# Altium project ADH_XC7Z010_SoC.PrjPcb (part 9 of 10)

## Sheet DDR3L_Modules.SchDoc: DDR3L Modules
size A3; DrawnBy: Emre Can Damyanlı; Revision: A.1; SheetNumber: 8; SheetTotal: 8; ENG_APP_DATE: --/--/--; DSN_APP_DATE: --/--/--; CHK_APP_DATE: --/--/--
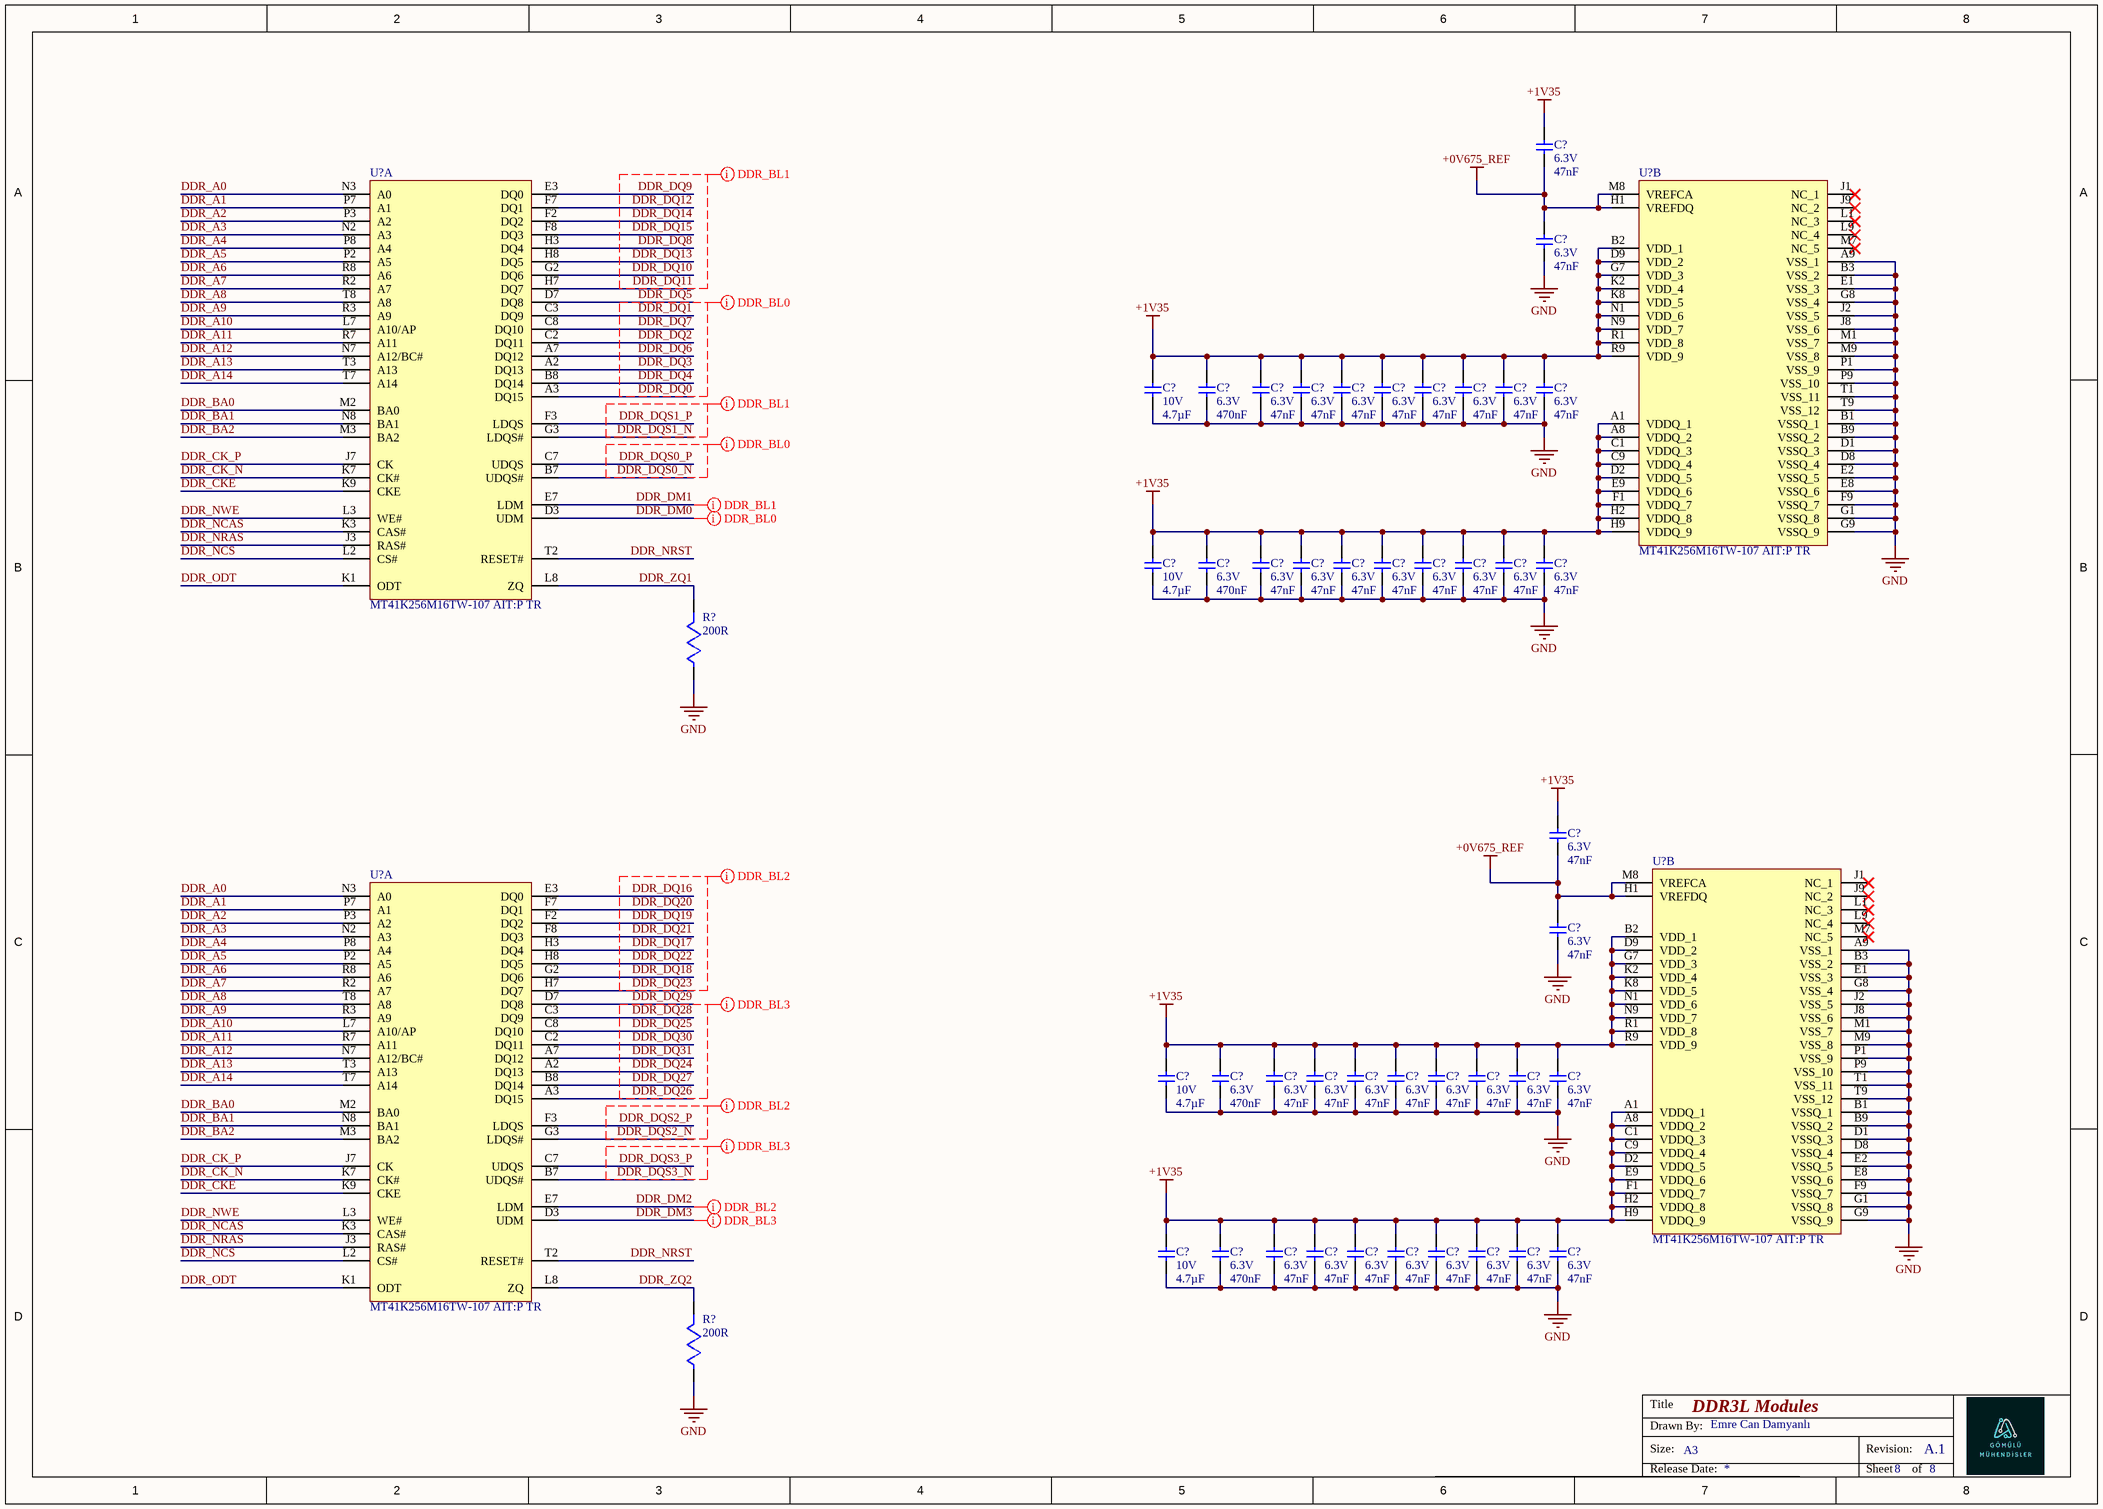
[diagram p7: DDR3L_Modules.SchDoc]

### Parts
(Parts that share a designator on the sheet are numbered #1, #2 ... from top to bottom, then left to right.)
C?#143  value 47nF  Voltage Rating: 6.3V  [CAPC0603X33N]  (hidden comment: GRM033C80J473KE19D)
C?#144  value 47nF  Voltage Rating: 6.3V  [CAPC0603X33N]  (hidden comment: GRM033C80J473KE19D)
C?#145  value 4.7µF  Voltage Rating: 10V  [CAPC1005X55N]  (hidden comment: CL05A475MP5NRNC)
C?#146  value 470nF  Voltage Rating: 6.3V  [CAPC0603X33N]  (hidden comment: GRM033R60J474KE90D)
C?#147  value 47nF  Voltage Rating: 6.3V  [CAPC0603X33N]  (hidden comment: GRM033C80J473KE19D)
C?#148  value 47nF  Voltage Rating: 6.3V  [CAPC0603X33N]  (hidden comment: GRM033C80J473KE19D)
C?#149  value 47nF  Voltage Rating: 6.3V  [CAPC0603X33N]  (hidden comment: GRM033C80J473KE19D)
C?#150  value 47nF  Voltage Rating: 6.3V  [CAPC0603X33N]  (hidden comment: GRM033C80J473KE19D)
C?#151  value 47nF  Voltage Rating: 6.3V  [CAPC0603X33N]  (hidden comment: GRM033C80J473KE19D)
C?#152  value 47nF  Voltage Rating: 6.3V  [CAPC0603X33N]  (hidden comment: GRM033C80J473KE19D)
C?#153  value 47nF  Voltage Rating: 6.3V  [CAPC0603X33N]  (hidden comment: GRM033C80J473KE19D)
C?#154  value 47nF  Voltage Rating: 6.3V  [CAPC0603X33N]  (hidden comment: GRM033C80J473KE19D)
C?#155  value 4.7µF  Voltage Rating: 10V  [CAPC1005X55N]  (hidden comment: CL05A475MP5NRNC)
C?#156  value 470nF  Voltage Rating: 6.3V  [CAPC0603X33N]  (hidden comment: GRM033R60J474KE90D)
C?#157  value 47nF  Voltage Rating: 6.3V  [CAPC0603X33N]  (hidden comment: GRM033C80J473KE19D)
C?#158  value 47nF  Voltage Rating: 6.3V  [CAPC0603X33N]  (hidden comment: GRM033C80J473KE19D)
C?#159  value 47nF  Voltage Rating: 6.3V  [CAPC0603X33N]  (hidden comment: GRM033C80J473KE19D)
C?#160  value 47nF  Voltage Rating: 6.3V  [CAPC0603X33N]  (hidden comment: GRM033C80J473KE19D)
C?#161  value 47nF  Voltage Rating: 6.3V  [CAPC0603X33N]  (hidden comment: GRM033C80J473KE19D)
C?#162  value 47nF  Voltage Rating: 6.3V  [CAPC0603X33N]  (hidden comment: GRM033C80J473KE19D)
C?#163  value 47nF  Voltage Rating: 6.3V  [CAPC0603X33N]  (hidden comment: GRM033C80J473KE19D)
C?#164  value 47nF  Voltage Rating: 6.3V  [CAPC0603X33N]  (hidden comment: GRM033C80J473KE19D)
C?#165  value 47nF  Voltage Rating: 6.3V  [CAPC0603X33N]  (hidden comment: GRM033C80J473KE19D)
C?#166  value 47nF  Voltage Rating: 6.3V  [CAPC0603X33N]  (hidden comment: GRM033C80J473KE19D)
C?#167  value 4.7µF  Voltage Rating: 10V  [CAPC1005X55N]  (hidden comment: CL05A475MP5NRNC)
C?#168  value 470nF  Voltage Rating: 6.3V  [CAPC0603X33N]  (hidden comment: GRM033R60J474KE90D)
C?#169  value 47nF  Voltage Rating: 6.3V  [CAPC0603X33N]  (hidden comment: GRM033C80J473KE19D)
C?#170  value 47nF  Voltage Rating: 6.3V  [CAPC0603X33N]  (hidden comment: GRM033C80J473KE19D)
C?#171  value 47nF  Voltage Rating: 6.3V  [CAPC0603X33N]  (hidden comment: GRM033C80J473KE19D)
C?#172  value 47nF  Voltage Rating: 6.3V  [CAPC0603X33N]  (hidden comment: GRM033C80J473KE19D)
C?#173  value 47nF  Voltage Rating: 6.3V  [CAPC0603X33N]  (hidden comment: GRM033C80J473KE19D)
C?#174  value 47nF  Voltage Rating: 6.3V  [CAPC0603X33N]  (hidden comment: GRM033C80J473KE19D)
C?#175  value 47nF  Voltage Rating: 6.3V  [CAPC0603X33N]  (hidden comment: GRM033C80J473KE19D)
C?#176  value 47nF  Voltage Rating: 6.3V  [CAPC0603X33N]  (hidden comment: GRM033C80J473KE19D)
C?#177  value 4.7µF  Voltage Rating: 10V  [CAPC1005X55N]  (hidden comment: CL05A475MP5NRNC)
C?#178  value 470nF  Voltage Rating: 6.3V  [CAPC0603X33N]  (hidden comment: GRM033R60J474KE90D)
C?#179  value 47nF  Voltage Rating: 6.3V  [CAPC0603X33N]  (hidden comment: GRM033C80J473KE19D)
C?#180  value 47nF  Voltage Rating: 6.3V  [CAPC0603X33N]  (hidden comment: GRM033C80J473KE19D)
C?#181  value 47nF  Voltage Rating: 6.3V  [CAPC0603X33N]  (hidden comment: GRM033C80J473KE19D)
C?#182  value 47nF  Voltage Rating: 6.3V  [CAPC0603X33N]  (hidden comment: GRM033C80J473KE19D)
C?#183  value 47nF  Voltage Rating: 6.3V  [CAPC0603X33N]  (hidden comment: GRM033C80J473KE19D)
C?#184  value 47nF  Voltage Rating: 6.3V  [CAPC0603X33N]  (hidden comment: GRM033C80J473KE19D)
C?#185  value 47nF  Voltage Rating: 6.3V  [CAPC0603X33N]  (hidden comment: GRM033C80J473KE19D)
C?#186  value 47nF  Voltage Rating: 6.3V  [CAPC0603X33N]  (hidden comment: GRM033C80J473KE19D)
R?#134  value 200R  [RESISTOR_0603]  (hidden comment: RC0603FR-07200RL)
R?#135  value 200R  [RESISTOR_0603]  (hidden comment: RC0603FR-07200RL)
U?#23  MT41K256M16TW-107 AIT:P TR  [BGA96C80P9X16_800X1400X120]  (part B of 2)
U?#24  MT41K256M16TW-107 AIT:P TR  [BGA96C80P9X16_800X1400X120]  (part A of 2)
U?#25  MT41K256M16TW-107 AIT:P TR  [BGA96C80P9X16_800X1400X120]  (part B of 2)
U?#26  MT41K256M16TW-107 AIT:P TR  [BGA96C80P9X16_800X1400X120]  (part A of 2)

### Nets
+0V675_REF: C?#143.1 C?#144.2 C?#165.1 C?#166.2 U?#23.H1(VREFDQ) U?#23.M8(VREFCA) U?#25.H1(VREFDQ) U?#25.M8(VREFCA)
+1V35: C?#143.2 C?#145.2 C?#146.2 C?#147.2 C?#148.2 C?#149.2 C?#150.2 C?#151.2 C?#152.2 C?#153.2 C?#154.2 C?#155.2 C?#156.2 C?#157.2 C?#158.2 C?#159.2 C?#160.2 C?#161.2 C?#162.2 C?#163.2 C?#164.2 C?#165.2 C?#167.2 C?#168.2 C?#169.2 C?#170.2 C?#171.2 C?#172.2 C?#173.2 C?#174.2 C?#175.2 C?#176.2 C?#177.2 C?#178.2 C?#179.2 C?#180.2 C?#181.2 C?#182.2 C?#183.2 C?#184.2 C?#185.2 C?#186.2 U?#23.A1(VDDQ_1) U?#23.A8(VDDQ_2) U?#23.B2(VDD_1) U?#23.C1(VDDQ_3) U?#23.C9(VDDQ_4) U?#23.D2(VDDQ_5) U?#23.D9(VDD_2) U?#23.E9(VDDQ_6) U?#23.F1(VDDQ_7) U?#23.G7(VDD_3) U?#23.H2(VDDQ_8) U?#23.H9(VDDQ_9) U?#23.K2(VDD_4) U?#23.K8(VDD_5) U?#23.N1(VDD_6) U?#23.N9(VDD_7) U?#23.R1(VDD_8) U?#23.R9(VDD_9) U?#25.A1(VDDQ_1) U?#25.A8(VDDQ_2) U?#25.B2(VDD_1) U?#25.C1(VDDQ_3) U?#25.C9(VDDQ_4) U?#25.D2(VDDQ_5) U?#25.D9(VDD_2) U?#25.E9(VDDQ_6) U?#25.F1(VDDQ_7) U?#25.G7(VDD_3) U?#25.H2(VDDQ_8) U?#25.H9(VDDQ_9) U?#25.K2(VDD_4) U?#25.K8(VDD_5) U?#25.N1(VDD_6) U?#25.N9(VDD_7) U?#25.R1(VDD_8) U?#25.R9(VDD_9)
GND: C?#144.1 C?#145.1 C?#146.1 C?#147.1 C?#148.1 C?#149.1 C?#150.1 C?#151.1 C?#152.1 C?#153.1 C?#154.1 C?#155.1 C?#156.1 C?#157.1 C?#158.1 C?#159.1 C?#160.1 C?#161.1 C?#162.1 C?#163.1 C?#164.1 C?#166.1 C?#167.1 C?#168.1 C?#169.1 C?#170.1 C?#171.1 C?#172.1 C?#173.1 C?#174.1 C?#175.1 C?#176.1 C?#177.1 C?#178.1 C?#179.1 C?#180.1 C?#181.1 C?#182.1 C?#183.1 C?#184.1 C?#185.1 C?#186.1 R?#134.1 R?#135.1 U?#23.A9(VSS_1) U?#23.B1(VSSQ_1) U?#23.B3(VSS_2) U?#23.B9(VSSQ_2) U?#23.D1(VSSQ_3) U?#23.D8(VSSQ_4) U?#23.E1(VSS_3) U?#23.E2(VSSQ_5) U?#23.E8(VSSQ_6) U?#23.F9(VSSQ_7) U?#23.G1(VSSQ_8) U?#23.G8(VSS_4) U?#23.G9(VSSQ_9) U?#23.J2(VSS_5) U?#23.J8(VSS_6) U?#23.M1(VSS_7) U?#23.M9(VSS_8) U?#23.P1(VSS_9) U?#23.P9(VSS_10) U?#23.T1(VSS_11) U?#23.T9(VSS_12) U?#25.A9(VSS_1) U?#25.B1(VSSQ_1) U?#25.B3(VSS_2) U?#25.B9(VSSQ_2) U?#25.D1(VSSQ_3) U?#25.D8(VSSQ_4) U?#25.E1(VSS_3) U?#25.E2(VSSQ_5) U?#25.E8(VSSQ_6) U?#25.F9(VSSQ_7) U?#25.G1(VSSQ_8) U?#25.G8(VSS_4) U?#25.G9(VSSQ_9) U?#25.J2(VSS_5) U?#25.J8(VSS_6) U?#25.M1(VSS_7) U?#25.M9(VSS_8) U?#25.P1(VSS_9) U?#25.P9(VSS_10) U?#25.T1(VSS_11) U?#25.T9(VSS_12)
DDR_A0: U?#24.N3(A0) U?#26.N3(A0)
DDR_A1: U?#24.P7(A1) U?#26.P7(A1)
DDR_A2: U?#24.P3(A2) U?#26.P3(A2)
DDR_A3: U?#24.N2(A3) U?#26.N2(A3)
DDR_A4: U?#24.P8(A4) U?#26.P8(A4)
DDR_A5: U?#24.P2(A5) U?#26.P2(A5)
DDR_A6: U?#24.R8(A6) U?#26.R8(A6)
DDR_A7: U?#24.R2(A7) U?#26.R2(A7)
DDR_A8: U?#24.T8(A8) U?#26.T8(A8)
DDR_A9: U?#24.R3(A9) U?#26.R3(A9)
DDR_A10: U?#24.L7(A10/AP) U?#26.L7(A10/AP)
DDR_A11: U?#24.R7(A11) U?#26.R7(A11)
DDR_A12: U?#24.N7(A12/BC#) U?#26.N7(A12/BC#)
DDR_A13: U?#24.T3(A13) U?#26.T3(A13)
DDR_A14: U?#24.T7(A14) U?#26.T7(A14)
DDR_BA0: U?#24.M2(BA0) U?#26.M2(BA0)
DDR_BA1: U?#24.N8(BA1) U?#26.N8(BA1)
DDR_BA2: U?#24.M3(BA2) U?#26.M3(BA2)
DDR_CK_N: U?#24.K7(CK#) U?#26.K7(CK#)
DDR_CK_P: U?#24.J7(CK) U?#26.J7(CK)
DDR_CKE: U?#24.K9(CKE) U?#26.K9(CKE)
DDR_DM0: U?#24.D3(UDM)
DDR_DM1: U?#24.E7(LDM)
DDR_DM2: U?#26.E7(LDM)
DDR_DM3: U?#26.D3(UDM)
DDR_DQ0: U?#24.A3(DQ15)
DDR_DQ1: U?#24.C3(DQ9)
DDR_DQ2: U?#24.C2(DQ11)
DDR_DQ3: U?#24.A2(DQ13)
DDR_DQ4: U?#24.B8(DQ14)
DDR_DQ5: U?#24.D7(DQ8)
DDR_DQ6: U?#24.A7(DQ12)
DDR_DQ7: U?#24.C8(DQ10)
DDR_DQ8: U?#24.H3(DQ4)
DDR_DQ9: U?#24.E3(DQ0)
DDR_DQ10: U?#24.G2(DQ6)
DDR_DQ11: U?#24.H7(DQ7)
DDR_DQ12: U?#24.F7(DQ1)
DDR_DQ13: U?#24.H8(DQ5)
DDR_DQ14: U?#24.F2(DQ2)
DDR_DQ15: U?#24.F8(DQ3)
DDR_DQ16: U?#26.E3(DQ0)
DDR_DQ17: U?#26.H3(DQ4)
DDR_DQ18: U?#26.G2(DQ6)
DDR_DQ19: U?#26.F2(DQ2)
DDR_DQ20: U?#26.F7(DQ1)
DDR_DQ21: U?#26.F8(DQ3)
DDR_DQ22: U?#26.H8(DQ5)
DDR_DQ23: U?#26.H7(DQ7)
DDR_DQ24: U?#26.A2(DQ13)
DDR_DQ25: U?#26.C8(DQ10)
DDR_DQ26: U?#26.A3(DQ15)
DDR_DQ27: U?#26.B8(DQ14)
DDR_DQ28: U?#26.C3(DQ9)
DDR_DQ29: U?#26.D7(DQ8)
DDR_DQ30: U?#26.C2(DQ11)
DDR_DQ31: U?#26.A7(DQ12)
DDR_DQS0_N: U?#24.B7(UDQS#)
DDR_DQS0_P: U?#24.C7(UDQS)
DDR_DQS1_N: U?#24.G3(LDQS#)
DDR_DQS1_P: U?#24.F3(LDQS)
DDR_DQS2_N: U?#26.G3(LDQS#)
DDR_DQS2_P: U?#26.F3(LDQS)
DDR_DQS3_N: U?#26.B7(UDQS#)
DDR_DQS3_P: U?#26.C7(UDQS)
DDR_NCAS: U?#24.K3(CAS#) U?#26.K3(CAS#)
DDR_NCS: U?#24.L2(CS#) U?#26.L2(CS#)
DDR_NRAS: U?#24.J3(RAS#) U?#26.J3(RAS#)
DDR_NRST: U?#24.T2(RESET#) U?#26.T2(RESET#)
DDR_NWE: U?#24.L3(WE#) U?#26.L3(WE#)
DDR_ODT: U?#24.K1(ODT) U?#26.K1(ODT)
DDR_ZQ1: R?#134.2 U?#24.L8(ZQ)
DDR_ZQ2: R?#135.2 U?#26.L8(ZQ)

Not connected (* = marked no-connect by the designer): U?#23 J1(NC_1)* J9(NC_2)* L1(NC_3)* L9(NC_4)* M7(NC_5)*; U?#25 J1(NC_1)* J9(NC_2)* L1(NC_3)* L9(NC_4)* M7(NC_5)*

### Layout directives
mark named DDR_BL1: DDR_DM1, DDR_DQ8, DDR_DQ9, DDR_DQ10, DDR_DQ11, DDR_DQ12, DDR_DQ13, DDR_DQ14, DDR_DQ15, DDR_DQS1_N, DDR_DQS1_P
mark named DDR_BL0: DDR_DM0, DDR_DQ0, DDR_DQ1, DDR_DQ2, DDR_DQ3, DDR_DQ4, DDR_DQ5, DDR_DQ6, DDR_DQ7, DDR_DQS0_N, DDR_DQS0_P
mark named DDR_BL2: DDR_DM2, DDR_DQ16, DDR_DQ17, DDR_DQ18, DDR_DQ19, DDR_DQ20, DDR_DQ21, DDR_DQ22, DDR_DQ23, DDR_DQS2_N, DDR_DQS2_P
mark named DDR_BL3: DDR_DM3, DDR_DQ24, DDR_DQ25, DDR_DQ26, DDR_DQ27, DDR_DQ28, DDR_DQ29, DDR_DQ30, DDR_DQ31, DDR_DQS3_N, DDR_DQS3_P

### Notes on the sheet
- Title
- Size:
- Drawn By:
- A3
- Revision:
- Release Date:
- Sheet
- of

### Library data of the parts
C?#143 C?#144 C?#147-C?#154 C?#157-C?#166 C?#169-C?#176 C?#179-C?#186 = GRM033C80J473KE19D: 6.3V 47nF X6S ±10% 0201 Multilayer Ceramic Capacitors MLCC - SMD/SMT ROHS; Manufacturer: Murata; Manufacturer Lifecycle Status: IN PRODUCTION; Supplier: Arrow Electronics; Supplier Part Number: GRM033C80J473KE19D; Manufacturer Part Number: GRM033C80J473KE19D; RoHS: Compliant; Category: Ceramic Capacitors; Stock: 1925; Pricing: 1924=0,0007 (USD); Case/Package: 0201; Case Code (Imperial): 0201; Case Code (Metric): 0603; Depth: 300µm; Dielectric: X6S; Dielectric Material: Ceramic; Height: 300µm; Lead Free: Lead Free; Length: 600µm; Lifecycle Status: Production; Material: Ceramic; Max Operating Temperature: 105°C; Min Operating Temperature: -55°C; Mounting Technology: Surface Mount; Number of Terminals: 2; Radiation Hardening: No; REACH SVHC: Yes; Schedule B: 8532240020, 8532240020|8532240020|8532240020|8532240020|8532240020; Termination: SMD/SMT; Thickness: 300µm; Tolerance: 10%; Voltage Rating (DC): 6.3V; Width: 300µm; ComponentLink1URL: https://datasheet.octopart.com:443/GRM033C80J473KE19D-Murata-datasheet-14396169.pdf?src-supplier=Future+Electronics; ComponentLink1Description: https://datasheet.octopart.com:443/GRM033C80J473KE19D-Murata-datasheet-14396169.pdf?src-supplier=Future+Electronics; ComponentLink2URL: https://datasheet.octopart.com:443/GRM033C80J473KE19D-Murata-datasheet-96971104.pdf?src-supplier=Future+Electronics; ComponentLink2Description: https://datasheet.octopart.com:443/GRM033C80J473KE19D-Murata-datasheet-96971104.pdf?src-supplier=Future+Electronics; ComponentLink3URL: https://datasheet.octopart.com:443/GRM033C80J473KE19D-Murata-datasheet-22122223.pdf?src-supplier=Future+Electronics; ComponentLink3Description: https://datasheet.octopart.com:443/GRM033C80J473KE19D-Murata-datasheet-22122223.pdf?src-supplier=Future+Electronics; ComponentLink4URL: https://datasheet.octopart.com:443/GRM033C80J473KE19D-Murata-datasheet-44105362.pdf?src-supplier=Future+Electronics; ComponentLink4Description: https://datasheet.octopart.com:443/GRM033C80J473KE19D-Murata-datasheet-44105362.pdf?src-supplier=Future+Electronics; ComponentLink5URL: https://datasheet.octopart.com:443/GRM033C80J473KE19D-Murata-datasheet-165579666.pdf?src-supplier=TME; ComponentLink5Description: https://datasheet.octopart.com:443/GRM033C80J473KE19D-Murata-datasheet-165579666.pdf?src-supplier=TME; ComponentLink6URL: https://datasheet.octopart.com:443/GRM033C80J473KE19D-Murata-datasheet-141274201.pdf?src-supplier=Ciiva; ComponentLink6Description: https://datasheet.octopart.com:443/GRM033C80J473KE19D-Murata-datasheet-141274201.pdf?src-supplier=Ciiva; ComponentLink7URL: https://datasheet.octopart.com:443/GRM033C80J473KE19D-Murata-datasheet-140675416.pdf?src-supplier=Ciiva; ComponentLink7Description: https://datasheet.octopart.com:443/GRM033C80J473KE19D-Murata-datasheet-140675416.pdf?src-supplier=Ciiva; ComponentLink8URL: https://datasheet.octopart.com:443/GRM033C80J473KE19D-Murata-datasheet-138738209.pdf?src-supplier=Ciiva; ComponentLink8Description: https://datasheet.octopart.com:443/GRM033C80J473KE19D-Murata-datasheet-138738209.pdf?src-supplier=Ciiva; ComponentLink9URL: https://datasheet.octopart.com:443/GRM033C80J473KE19D-Murata-datasheet-32479577.pdf?src-supplier=HQonline; ComponentLink9Description: https://datasheet.octopart.com:443/GRM033C80J473KE19D-Murata-datasheet-32479577.pdf?src-supplier=HQonline; ComponentLink10URL: https://datasheet.octopart.com/GRM033C80J473KE19D-Murata-datasheet-12515295.pdf; ComponentLink10Description: https://datasheet.octopart.com/GRM033C80J473KE19D-Murata-datasheet-12515295.pdf; ComponentLink11URL: https://datasheet.octopart.com/GRM033C80J473KE19D-Murata-datasheet-12510076.pdf; ComponentLink11Description: https://datasheet.octopart.com/GRM033C80J473KE19D-Murata-datasheet-12510076.pdf; ComponentLink12URL: https://datasheet.octopart.com/GRM033C80J473KE19D-Murata-datasheet-11978611.pdf; ComponentLink12Description: https://datasheet.octopart.com/GRM033C80J473KE19D-Murata-datasheet-11978611.pdf; ComponentLink13URL: https://datasheet.octopart.com/GRM033C80J473KE19D-Murata-datasheet-10025737.pdf; ComponentLink13Description: https://datasheet.octopart.com/GRM033C80J473KE19D-Murata-datasheet-10025737.pdf; ComponentLink14URL: https://datasheet.octopart.com/GRM033C80J473KE19D-Murata-datasheet-8819587.pdf; ComponentLink14Description: https://datasheet.octopart.com/GRM033C80J473KE19D-Murata-datasheet-8819587.pdf; ComponentLink15URL: https://datasheet.octopart.com:443/GRM033C80J473KE19D-Murata-datasheet-150009104.pdf?src-supplier=Arrow.cn; ComponentLink15Description: https://datasheet.octopart.com:443/GRM033C80J473KE19D-Murata-datasheet-150009104.pdf?src-supplier=Arrow.cn; ComponentLink16URL: http://sigma.octopart.com:80/reach_statement/Murata-company-16.pdf?src-supplier=Compliance+Statements; ComponentLink16Description: http://sigma.octopart.com:80/reach_statement/Murata-company-16.pdf?src-supplier=Compliance+Statements
C?#145 C?#155 C?#167 C?#177 = CL05A475MP5NRNC: as C?#123-C?#125 on sheet Zynq_PS_System; Supplier: Avnet; Supplier Part Number: CL05A475MP5NRNC; Manufacturer Part Number: CL05A475MP5NRNC; RoHS: Compliant; Category: Ceramic Capacitors; Stock: 40000; Pricing: 10000=0,00671, 20000=0,00663, 40000=0,0066, 80000=0,00656, 160000=0,00653 (USD); Case/Package: 0402; Case Code (Imperial): 0402; Case Code (Metric): 1005; China RoHS: Compliant; Dielectric: X5R; Dielectric Material: Ceramic; Height: 500µm; Lead Free: Lead Free; Length: 1mm; Lifecycle Status: Production; Material: Ceramic; Max Operating Temperature: 85°C; Min Operating Temperature: -55°C; Mounting Technology: Surface Mount; Number of Terminals: 2; REACH SVHC: Yes; Schedule B: 8532240020, 8532240020|8532240020|8532240020|8532240020|8532240020|8532240020|8532240020|8532240020|8532240020|8532240020|8532240020|8532240020|8532240020|8532240020|8532240020|8532240020|8532240020|8532240020|8532240020|8532240020|8532240020|8532240020, 8532240020|8532240020|8532240020|8532240020|8532240020|8532240020|8532240020|8532240020|8532240020|8532240020|8532240020|8532240020|8532240020|8532240020|8532240020|8532240020|8532240020|8532240020|8532240020|8532240020|8532240020|8532240020|8532240020, 8532240020|8532240020|8532240020|8532240020|8532240020|8532240020|8532240020|8532240020|8532240020|8532240020|8532240020|8532240020|8532240020|8532240020|8532240020|8532240020|8532240020|8532240020|8532240020|8532240020|8532240020|8532240020|8532240020|85; Thickness: 558.8µm; Tolerance: 20%; Voltage Rating (DC): 10V; Width: 500µm; ComponentLink1URL: https://datasheet.octopart.com:443/CL05A475MP5NRNC-Samsung-Electro-Mechanics-datasheet-181551186.pdf?src-supplier=Newark; ComponentLink1Description: https://datasheet.octopart.com:443/CL05A475MP5NRNC-Samsung-Electro-Mechanics-datasheet-181551186.pdf?src-supplier=Newark; ComponentLink2URL: https://datasheet.octopart.com:443/CL05A475MP5NRNC-Samsung-Electro-Mechanics-datasheet-136482298.pdf?src-supplier=Newark; ComponentLink2Description: https://datasheet.octopart.com:443/CL05A475MP5NRNC-Samsung-Electro-Mechanics-datasheet-136482298.pdf?src-supplier=Newark; ComponentLink3URL: https://datasheet.octopart.com:443/CL05A475MP5NRNC-Samsung-Electro-Mechanics-datasheet-136031736.pdf?src-supplier=Future+Electronics; ComponentLink3Description: https://datasheet.octopart.com:443/CL05A475MP5NRNC-Samsung-Electro-Mechanics-datasheet-136031736.pdf?src-supplier=Future+Electronics; ComponentLink4URL: https://datasheet.octopart.com:443/CL05A475MP5NRNC-Samsung-Electro-Mechanics-datasheet-110226226.pdf?src-supplier=Future+Electronics; ComponentLink4Description: https://datasheet.octopart.com:443/CL05A475MP5NRNC-Samsung-Electro-Mechanics-datasheet-110226226.pdf?src-supplier=Future+Electronics; ComponentLink5URL: https://datasheet.octopart.com:443/CL05A475MP5NRNC-Samsung-Electro-Mechanics-datasheet-87580058.pdf?src-supplier=Future+Electronics; ComponentLink5Description: https://datasheet.octopart.com:443/CL05A475MP5NRNC-Samsung-Electro-Mechanics-datasheet-87580058.pdf?src-supplier=Future+Electronics; ComponentLink6URL: https://datasheet.octopart.com:443/CL05A475MP5NRNC-Samsung-Electro-Mechanics-datasheet-81461611.pdf?src-supplier=Future+Electronics; ComponentLink6Description: https://datasheet.octopart.com:443/CL05A475MP5NRNC-Samsung-Electro-Mechanics-datasheet-81461611.pdf?src-supplier=Future+Electronics; ComponentLink7URL: https://datasheet.octopart.com:443/CL05A475MP5NRNC-Samsung-datasheet-48647200.pdf?src-supplier=Future+Electronics; ComponentLink7Description: https://datasheet.octopart.com:443/CL05A475MP5NRNC-Samsung-datasheet-48647200.pdf?src-supplier=Future+Electronics; ComponentLink8URL: https://datasheet.octopart.com:443/CL05A475MP5NRNC-Samsung-datasheet-34153549.pdf?src-supplier=Future+Electronics; ComponentLink8Description: https://datasheet.octopart.com:443/CL05A475MP5NRNC-Samsung-datasheet-34153549.pdf?src-supplier=Future+Electronics; ComponentLink9URL: https://datasheet.octopart.com:443/CL05A475MP5NRNC-Samsung-datasheet-26589015.pdf?src-supplier=Future+Electronics; ComponentLink9Description: https://datasheet.octopart.com:443/CL05A475MP5NRNC-Samsung-datasheet-26589015.pdf?src-supplier=Future+Electronics; ComponentLink10URL: https://datasheet.octopart.com:443/CL05A475MP5NRNC-Samsung-datasheet-8324245.pdf?src-supplier=Future+Electronics; ComponentLink10Description: https://datasheet.octopart.com:443/CL05A475MP5NRNC-Samsung-datasheet-8324245.pdf?src-supplier=Future+Electronics; ComponentLink11URL: https://datasheet.octopart.com:443/CL05A475MP5NRNC-Samsung-Electro-Mechanics-datasheet-149136695.pdf?src-supplier=Future+Electronics; ComponentLink11Description: https://datasheet.octopart.com:443/CL05A475MP5NRNC-Samsung-Electro-Mechanics-datasheet-149136695.pdf?src-supplier=Future+Electronics; ComponentLink12URL: https://datasheet.octopart.com:443/CL05A475MP5NRNC-Samsung-datasheet-8326407.pdf?src-supplier=TME; ComponentLink12Description: https://datasheet.octopart.com:443/CL05A475MP5NRNC-Samsung-datasheet-8326407.pdf?src-supplier=TME
C?#146 C?#156 C?#168 C?#178 = GRM033R60J474KE90D: as C?#133-C?#136 on sheet Zynq_DDR_Interface; Supplier: Arrow Electronics; Supplier Part Number: GRM033R60J474KE90D; Manufacturer Part Number: GRM033R60J474KE90D; RoHS: Compliant; Category: Ceramic Capacitors; Stock: 1170000; Pricing: 15000=0,004 (USD); Case/Package: 0201; Case Code (Imperial): 0201; Case Code (Metric): 0603; Depth: 300µm; Dielectric: X5R; Dielectric Material: Ceramic; Height: 300µm; Lead Free: Lead Free; Length: 600µm; Lifecycle Status: Production; Material: Ceramic; Max Operating Temperature: 85°C; Min Operating Temperature: -55°C; Mounting Technology: Surface Mount; Number of Terminals: 2; Packaging: Tape & Reel (TR); REACH SVHC: Yes; Schedule B: 8532240020, 8532240020|8532240020, 8532240020|8532240020|8532240020, 8532240020|8532240020|8532240020|8532240020; Termination: SMD/SMT; Thickness: 300µm; Tolerance: 10%; Voltage Rating (DC): 6.3V; Weight: 340.194278µg; Width: 300µm; ComponentLink1URL: https://datasheet.octopart.com:443/GRM033R60J474KE90D-Murata-datasheet-165579666.pdf?src-supplier=TME; ComponentLink1Description: https://datasheet.octopart.com:443/GRM033R60J474KE90D-Murata-datasheet-165579666.pdf?src-supplier=TME; ComponentLink2URL: https://datasheet.octopart.com:443/GRM033R60J474KE90D-Murata-datasheet-141274201.pdf?src-supplier=Ciiva; ComponentLink2Description: https://datasheet.octopart.com:443/GRM033R60J474KE90D-Murata-datasheet-141274201.pdf?src-supplier=Ciiva; ComponentLink3URL: https://datasheet.octopart.com:443/GRM033R60J474KE90D-Murata-datasheet-140676048.pdf?src-supplier=Ciiva; ComponentLink3Description: https://datasheet.octopart.com:443/GRM033R60J474KE90D-Murata-datasheet-140676048.pdf?src-supplier=Ciiva; ComponentLink4URL: https://datasheet.octopart.com:443/GRM033R60J474KE90D-Murata-datasheet-138738366.pdf?src-supplier=Ciiva; ComponentLink4Description: https://datasheet.octopart.com:443/GRM033R60J474KE90D-Murata-datasheet-138738366.pdf?src-supplier=Ciiva; ComponentLink5URL: https://datasheet.octopart.com:443/GRM033R60J474KE90D-Murata-datasheet-22122223.pdf?src-supplier=Future+Electronics; ComponentLink5Description: https://datasheet.octopart.com:443/GRM033R60J474KE90D-Murata-datasheet-22122223.pdf?src-supplier=Future+Electronics; ComponentLink6URL: https://datasheet.octopart.com/GRM033R60J474KE90D-Murata-datasheet-12515295.pdf; ComponentLink6Description: https://datasheet.octopart.com/GRM033R60J474KE90D-Murata-datasheet-12515295.pdf; ComponentLink7URL: https://datasheet.octopart.com/GRM033R60J474KE90D-Murata-datasheet-12510076.pdf; ComponentLink7Description: https://datasheet.octopart.com/GRM033R60J474KE90D-Murata-datasheet-12510076.pdf; ComponentLink8URL: https://datasheet.octopart.com/GRM033R60J474KE90D-Murata-datasheet-11978611.pdf; ComponentLink8Description: https://datasheet.octopart.com/GRM033R60J474KE90D-Murata-datasheet-11978611.pdf; ComponentLink9URL: https://datasheet.octopart.com/GRM033R60J474KE90D-Murata-datasheet-10025737.pdf; ComponentLink9Description: https://datasheet.octopart.com/GRM033R60J474KE90D-Murata-datasheet-10025737.pdf; ComponentLink10URL: https://datasheet.octopart.com/GRM033R60J474KE90D-Murata-datasheet-8819587.pdf; ComponentLink10Description: https://datasheet.octopart.com/GRM033R60J474KE90D-Murata-datasheet-8819587.pdf; ComponentLink11URL: https://datasheet.octopart.com/GRM033R60J474KE90D-Murata-datasheet-17503195.pdf; ComponentLink11Description: https://datasheet.octopart.com/GRM033R60J474KE90D-Murata-datasheet-17503195.pdf; ComponentLink12URL: https://datasheet.octopart.com:443/GRM033R60J474KE90D-Murata-datasheet-150839311.pdf?src-supplier=Arrow.cn; ComponentLink12Description: https://datasheet.octopart.com:443/GRM033R60J474KE90D-Murata-datasheet-150839311.pdf?src-supplier=Arrow.cn; ComponentLink13URL: http://sigma.octopart.com:80/reach_statement/Murata-company-16.pdf?src-supplier=Compliance+Statements; ComponentLink13Description: http://sigma.octopart.com:80/reach_statement/Murata-company-16.pdf?src-supplier=Compliance+Statements
R?#134 R?#135 = RC0603FR-07200RL: SMD Chip Resistor, 200 Ohm, ± 1%, 100 mW, 0603 [1608 Metric], Thick Film, General Purpose; Manufacturer: Yageo; Power Rating: 100mW; Voltage Rating: 50V; Temperature Coefficient: 100ppm/°C; Working Voltage: 75V; Supplier: Digikey; Supplier Part Number: 311-200HRCT-ND; Manufacturer Part Number: RC0603FR-07200RL; RoHS: Yes; Category: Chip SMD Resistors; Stock: 439500; Pricing: 1=0,1, 10=0,019, 50=0,0112, 100=0,0093, 500=0,00622, 1000=0,00532 (USD); Case/Package: 0603; Pins: 2; Case Code (Imperial): 0603; Case Code (Metric): 1608; Min Operating Temperature: -55°C; Max Operating Temperature: 155°C; Packaging: Tape and Reel; Tolerance: 1%; Package Quantity: 5000; Termination: SMD/SMT; Resistor Type: Thick Film; Number of Terminations: 2; Features: Moisture Resistant; Series: RC; Max Power Dissipation: 100mW; Resistance Tolerance: 1%; Construction: Rectangular; Technology: THICK FILM; Voltage Rating (DC): 50V; Length: 1.6mm; Width: 0.8mm; Height: 0.45mm; Depth: 0.8mm; Reach SVHC Compliant: No; Military Standard: Not; Lead Free: Lead Free; RoHS Compliant: Yes; ComponentLink1URL: https://datasheet.ciiva.com/11809/0900766b80f96399-11809240.pdf?src-supplier=Rs; ComponentLink1Description: https://datasheet.ciiva.com/11809/0900766b80f96399-11809240.pdf?src-supplier=Rs; ComponentLink2URL: https://datasheet.ciiva.com/46395/443971-46395029.pdf?src-supplier=Element14; ComponentLink2Description: https://datasheet.ciiva.com/46395/443971-46395029.pdf?src-supplier=Element14
U?#23-U?#26 = MT41K256M16TW-107 AIT:P TR: 1.45 V 4 Gbit Parallel 933 MHz 20 ns SMT V00H SDRAM DDR3L Memory IC - FBGA-96; Manufacturer: Micron; Frequency: 933MHz; Memory Format: RAM, SDRAM; Supplier: Future Electronics; Supplier Part Number: 2197819; RoHS: Compliant; Category: RAM; Pricing: 2000=12,36 (USD); Case/Package: TFBGA; Interface: Parallel; Max Operating Temperature: 95°C; Min Operating Temperature: -40°C; ComponentLink1URL: https://datasheet.octopart.com:443/MT41K256M16TW-107-AIT%3AP-TR-Micron-datasheet-165810451.pdf?src-supplier=SHENGYU+ELECTRONICS; ComponentLink1Description: https://datasheet.octopart.com:443/MT41K256M16TW-107-AIT%3AP-TR-Micron-datasheet-165810451.pdf?src-supplier=SHENGYU+ELECTRONICS; Manufacturer Part Number: MT41K256M16TW-107 AIT:P TR